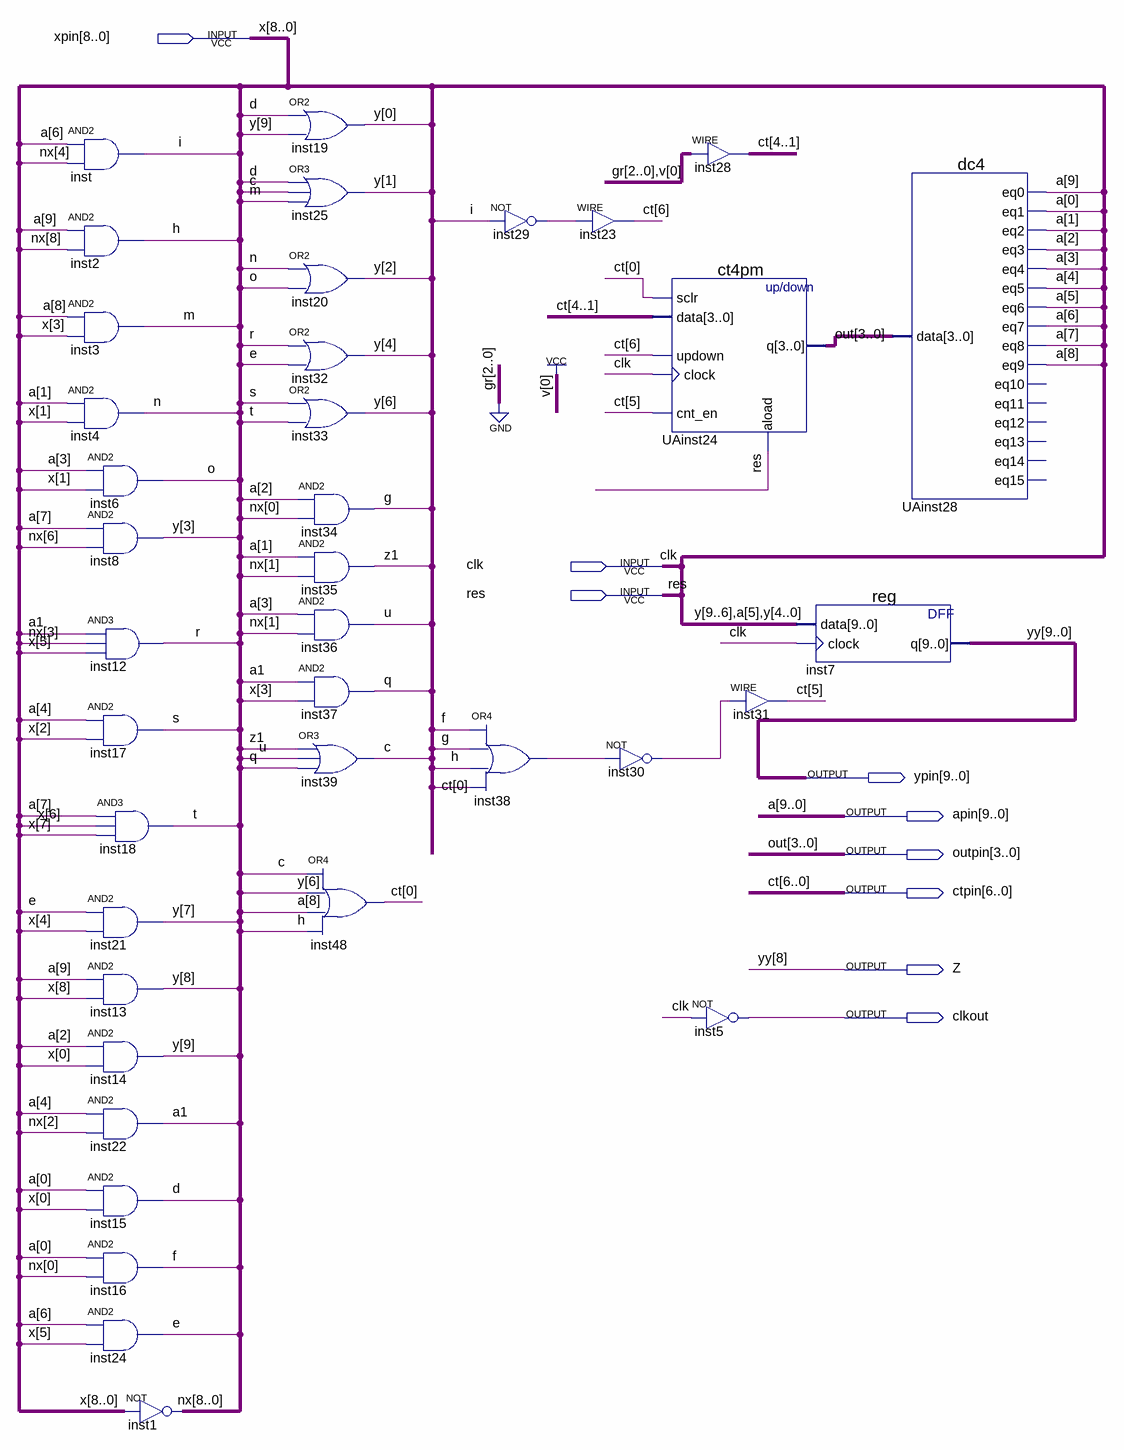
[diagram p0: schematic sheet]
// Quartus schematic UA.bdf as structural Verilog: 38 symbols, 9 pins
module UA (
  input  [8:0] xpin,
  input  clk,
  input  res,
  output [9:0] ypin,
  output [9:0] apin,
  output [3:0] outpin,
  output [6:0] ctpin,
  output Z,
  output clkout
);

  wire c, d, e, f, g, h, i, inst29_out, inst30_out, inst38_out, m, n, o, q, r, s, t, u, z1;
  wire [8:0] nx;
  wire [9:0] y;

  and inst (i, apin[6], nx[4]);
  and inst2 (h, apin[9], nx[8]);
  and inst3 (m, apin[8], xpin[3]);
  and inst4 (n, apin[1], xpin[1]);
  and inst6 (o, apin[3], xpin[1]);
  and inst8 (y[3], apin[7], nx[6]);
  and inst12 (r, apin[1], nx[3], xpin[5]);
  and inst17 (s, apin[4], xpin[2]);
  and inst18 (t, apin[7], xpin[6], xpin[7]);
  and inst21 (y[7], e, xpin[4]);
  and inst13 (y[8], apin[9], xpin[8]);
  and inst14 (y[9], apin[2], xpin[0]);
  and inst22 (apin[1], apin[4], nx[2]);
  and inst15 (d, apin[0], xpin[0]);
  and inst16 (f, apin[0], nx[0]);
  and inst24 (e, apin[6], xpin[5]);
  assign nx = ~xpin;  // NOT inst1, 9 bits wide
  or inst19 (y[0], d, y[9]);
  or inst25 (y[1], d, c, m);
  or inst20 (y[2], n, o);
  or inst32 (y[4], r, e);
  or inst33 (y[6], s, t);
  and inst34 (g, apin[2], nx[0]);
  and inst35 (z1, apin[1], nx[1]);
  and inst36 (u, apin[3], nx[1]);
  and inst37 (q, apin[1], xpin[3]);
  or inst39 (c, z1, u, q);
  or inst48 (ctpin[0], c, y[6], apin[8], h);
  not inst29 (inst29_out, i);
  or inst38 (inst38_out, f, g, h, ctpin[0]);
  assign ctpin[6] = inst29_out;  // WIRE inst23
  ct4pm UAinst24 (
    .sclr(ctpin[0]), .data(ctpin[4:1]), .updown(ctpin[6]), .clock(clk), .cnt_en(ctpin[5]), .aload(res),
    .q(outpin));
  not inst30 (inst30_out, inst38_out);
  assign ctpin[4:1] = 4'b0001;  // WIRE inst28
  assign ctpin[5] = inst30_out;  // WIRE inst31
  not inst5 (clkout, clk);
  \reg  inst7 (.data({y[9:6], apin[5], y[4:0]}), .clock(clk), .q(ypin));
  dc4 UAinst28 (
    .data(outpin), .eq0(apin[9]), .eq1(apin[0]), .eq2(apin[1]), .eq3(apin[2]), .eq4(apin[3]), .eq5(apin[4]),
    .eq6(apin[5]), .eq7(apin[6]), .eq8(apin[7]), .eq9(apin[8]));  // open: eq10, eq11, eq12, eq13, eq14, eq15

  assign Z = ypin[8];

  // Other names for the same wires on the sheet: a[9:0] = apin; a1 = apin[1]; ct[6:0] = ctpin; out[3:0] = outpin;
  //   x[8:0] = xpin; yy[9:0] = ypin
endmodule
